# Altium schematic sheet JacdacAccessSwitchInput 34.SchDoc: Complete design
size A4; DocumentNumber: 1; SheetNumber: 1; SheetTotal: 1; VersionControl_RevNumber: 1
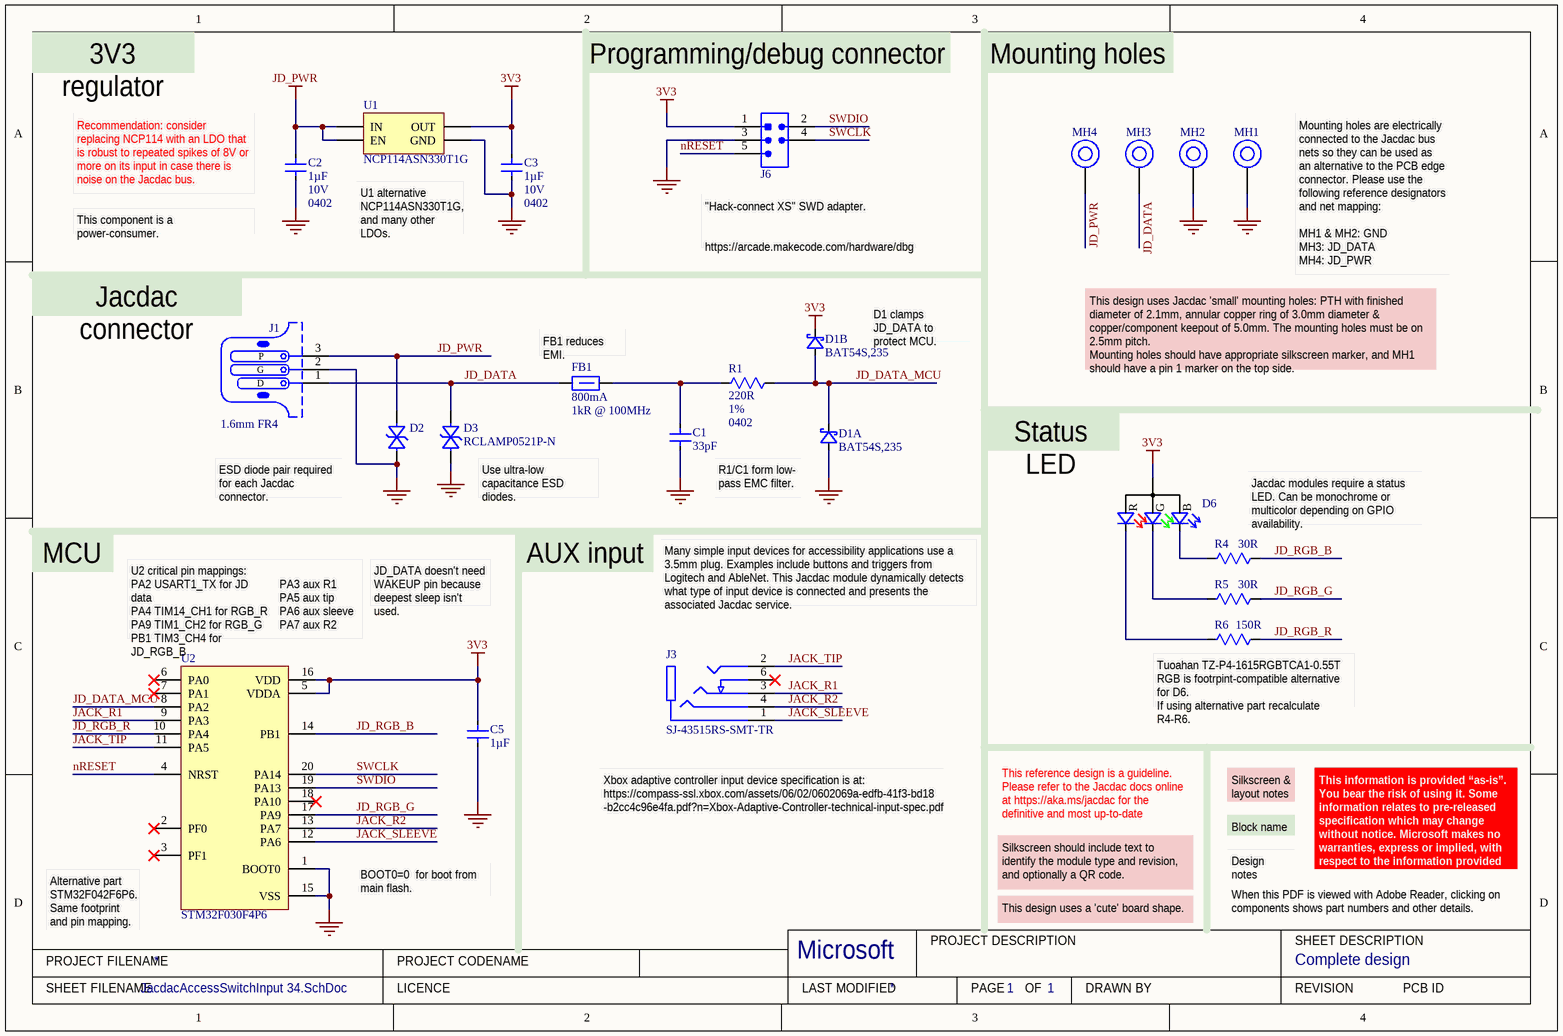
[diagram p0: JacdacAccessSwitchInput 34.SchDoc]

## Parts
C1  Capacitance: 33pF  [C0402_0.55MM - without outline]  (hidden comment: CL05C330JB51PNC)
C2  Capacitance: 1µF  Voltage Rating: 10V  Case Code (Imperial): 0402  [C0402_0.55MM - without outline]  (hidden comment: CL05A105KP5NNNC)
C3  Capacitance: 1µF  Voltage Rating: 10V  Case Code (Imperial): 0402  [C0402_0.55MM - without outline]  (hidden comment: CL05A105KP5NNNC)
C5  Capacitance: 1µF  [C0402_0.55MM - without outline]  (hidden comment: CL05A105KP5NNNC)
D1  Manufacturer Part Number: BAT54S,235  [NXP-BAT54S-TO-236AB - without outline]  (hidden comment: BAT54S)  (parts A,B of 2)
D2  RCLAMP0521P-N  [TVS 0402 - L]  (value not drawn)
D3  RCLAMP0521P-N  [TVS 0402 - L]
D6  HSMF-C114  [HSMF-C114]  (value not drawn)
FB1  Current Rating: 800mA  Impedance: 1kR @ 100MHz  [TDK MPZ1608 0.8mm - without outline]  (hidden comment: TDK MPZ1608S102ATA00)
J1  PCB Type: 1.6mm FR4  [JACDAC_EDGE_CONNECTOR_NO_TRACES]  (hidden comment: 3 pin JACDAC edge connector)  (no BOM)
J3  SJ2-43515RS-SMT  [SJ-43515RS-SMT-TR]  (value not drawn)
J6  Hack Connect Mini 1.27 mm pitch 2-row  [HACK_CONNECT_MINI_5_X_1_27]  (value not drawn)
MH1  MH_5.0MMK_3.0MMC_2.1MMD_PTH  [MH_5.0MMK_3.0MMC_2.1MMD_PTH]  (value not drawn)  (no BOM)
MH2  MH_5.0MMK_3.0MMC_2.1MMD_PTH  [MH_5.0MMK_3.0MMC_2.1MMD_PTH]  (value not drawn)  (no BOM)
MH3  MH_5.0MMK_3.0MMC_2.1MMD_PTH  [MH_5.0MMK_3.0MMC_2.1MMD_PTH]  (value not drawn)  (no BOM)
MH4  MH_5.0MMK_3.0MMC_2.1MMD_PTH  [MH_5.0MMK_3.0MMC_2.1MMD_PTH]  (value not drawn)  (no BOM)
R1  Resistance: 220R  Tolerance: 1%  Case Code (Imperial): 0402  [R0402 - Without outline]  (hidden comment: 0402WGF2200TCE)
R4  Resistance: 30R  [R0402 - Without outline]  (hidden comment: 0402WGF300JTCE)
R5  Resistance: 30R  [R0402 - Without outline]  (hidden comment: 0402WGF300JTCE)
R6  Resistance: 150R  [R0402 - Without outline]  (hidden comment: 0402WGF1500TCE)
U1  LDO 3.3V/300 mA  [ON_SEMI-SOT23-5 - without outline]  (value not drawn)
U2  STM32F030F4P6  [20-TSSOP]

## Nets
3V3: C3.2 C5.2 D1.2(K) D6.1(A) J6.1(VCC) U1.5(OUT) U2.5(VDDA) U2.16(VDD)
GND: C1.1 C2.1 C3.1 C5.1 D1.1(A) D2.2(A) D3.2(A) J1.2(G) J6.3(GND) MH1.1 MH2.1 U1.2(GND) U2.1(BOOT0) U2.15(VSS)
JD_PWR: C2.2 D2.1(K) J1.3(P) MH4.1 U1.1(IN) U1.3(EN)
JACK_R1: J3.3 U2.9(PA3)
JACK_R2: J3.4 U2.13(PA7)
JACK_SLEEVE: J3.1 U2.12(PA6)
JACK_TIP: J3.2 U2.11(PA5)
JD_DATA: D3.1(K) FB1.1 J1.1(D) MH3.1
JD_DATA_MCU: D1.3(K) R1.1 U2.8(PA2)
JD_RGB_B: R4.2 U2.14(PB1)
JD_RGB_G: R5.2 U2.17(PA9)
JD_RGB_R: R6.2 U2.10(PA4)
nRESET: J6.5(RESET) U2.4(NRST)
SWCLK: J6.4(SWCLK) U2.20(PA14)
SWDIO: J6.2(SWDIO) U2.19(PA13)
NetC1_2: C1.2 FB1.2 R1.2
NetD6_2: D6.2(R) R6.1
NetD6_3: D6.3(G) R5.1
NetD6_4: D6.4(B) R4.1

Not connected (* = marked no-connect by the designer): J3 6*; U2 2(PF0)* 3(PF1)* 6(PA0)* 7(PA1)* 18(PA10)*

## Notes on the sheet
- 3V3 regulator
- Programming/debug connector
- Mounting holes
- (near C2) Recommendation: consider replacing NCP114 with an LDO that is robust to repeated spikes of 8V or more on its input in case there is noise on the Jacdac bus.
- (near C2) This component is a power-consumer.
- U1 alternative
  NCP114ASN330T1G, and many other LDOs.
- (near J6) "Hack-connect XS" SWD adapter.
  https://arcade.makecode.com/hardware/dbg
- (near MH1) Mounting holes are electrically connected to the Jacdac bus nets so they can be used as an alternative to the PCB edge connector. Please use the following reference designators and net mapping:
- Jacdac connector
- MH1 & MH2: GND
  MH3: JD_DATA
  MH4: JD_PWR
- (near FB1) FB1 reduces EMI.
- D1 clamps JD_DATA to protect MCU.
- This design uses Jacdac 'small' mounting holes: PTH with finished diameter of 2.1mm, annular copper ring of 3.0mm diameter & copper/component keepout of 5.0mm. The mounting holes must be on 2.5mm pitch.
  Mounting holes should have appropriate silkscreen marker, and MH1 should have a pin 1 marker on the top side.
- (near D6) Status LED
- ESD diode pair required for each Jacdac connector.
- (near D3) Use ultra-low capacitance ESD diodes.
- R1/C1 form low-
  pass EMC filter.
- (near R4) Jacdac modules require a status LED. Can be monochrome or multicolor depending on GPIO availability.
- MCU
- AUX input
- (near U2) U2 critical pin mappings:
  PA2 USART1_TX for JD data
  PA4 TIM14_CH1 for RGB_R
  PA9 TIM1_CH2 for RGB_G
  PB1 TIM3_CH4 for JD_RGB_B
- (near U2) PA3 aux R1
  PA5 aux tip
  PA6 aux sleeve
  PA7 aux R2
- JD_DATA doesn't need WAKEUP pin because deepest sleep isn't used.
- Many simple input devices for accessibility applications use a 3.5mm plug. Examples include buttons and triggers from Logitech and AbleNet. This Jacdac module dynamically detects what type of input device is connected and presents the associated Jacdac service.
- (near R6) Tuoahan TZ-P4-1615RGBTCA1-0.55T RGB is footrpint-compatible alternative for D6.
  If using alternative part recalculate R4-R6.
- (near J3) Xbox adaptive controller input device specification is at:
  https://compass-ssl.xbox.com/assets/06/02/0602069a-edfb-41f3-bd18
  -b2cc4c96e4fa.pdf?n=Xbox-Adaptive-Controller-technical-input-spec.pdf
- This reference design is a guideline. Please refer to the Jacdac docs online at https://aka.ms/jacdac for the definitive and most up-to-date information.
- Block name
- Silkscreen & layout notes
- (near U2) Alternative part STM32F042F6P6. Same footprint and pin mapping.
- BOOT0=0  for boot from main flash.
- This design uses a 'cute' board shape.
- Silkscreen should include text to identify the module type and revision, and optionally a QR code.
- Design notes
- When this PDF is viewed with Adobe Reader, clicking on components shows part numbers and other details.
- This information is provided “as-is”. You bear the risk of using it. Some information relates to pre-released specification which may change without notice. Microsoft makes no warranties, express or implied, with respect to the information provided here.
- PROJECT FILENAME
- PROJECT CODENAME
- Microsoft
- PROJECT DESCRIPTION
- SHEET DESCRIPTION
- SHEET FILENAME
- LICENCE
- LAST MODIFIED
- PAGE
- OF
- DRAWN BY
- REVISION
- PCB ID

## Library data of the parts
C1 = CL05C330JB51PNC: CAP CER 33PF 50V NP0 0402; Manufacturer: Samsung; Tolerance: 5%; Supplier 1: Digi-Key; Manufacturer Part Number: CL05C330JB51PNC; RoHS: Yes; Category: Capacitors; Stock 1: 250654; Pricing 1: 1=0.10000, 10=0.07500, 50=0.04060, 100=0.03320, 500=0.02374, 1000=0.01865, 2500=0.01696, 5000=0.01560 (USD); Mount: Surface Mount; Case/Package: 0402; Case Code (Metric): 1005; Min Operating Temperature: -55°C; Max Operating Temperature: 125°C; Packaging: Tape and Reel; Length: 0.039inch; Width: 0.02inch; Thickness: 0.022inch; Ratings: AEC-Q200; Lead Free: Lead Free; ComponentLink1URL: http://www.samsungsem.com/kr/support/library/product-catalog/mlcc.jsp; ComponentLink1Description: Samsung datasheet online; Supplier 2: Mouser; Stock 2: 97900; Pricing 2: 1=0.11000, 10=0.08200, 100=0.03600, 500=0.02600, 1000=0.02000, 2500=0.01800 (USD); Supplier 3: Future Electronics; Stock 3: 100000; Pricing 3: 10000=0.00780 (USD); Supplier Part Number 3: 6022520; Supplier Part Number 2: 187-CL05C330JB51PNC; Checked: ?; Created: DG; Supplier Part Number 1: 1276-6515-1-ND; Voltage Rating: 50V; Case Code (Imperial): 0402
C2 C3 C5 = CL05A105KP5NNNC: CAP CER 1UF 10V X5R 0402; Manufacturer: Samsung; Material: Ceramic; Tolerance: 10%; Supplier 1: Digi-Key; Manufacturer Part Number: CL05A105KP5NNNC; RoHS: Yes; Category: Capacitors; Stock 1: 5705569; Pricing 1: 1=0.10000, 10=0.03900, 50=0.02100, 100=0.01720, 500=0.01228, 1000=0.00965, 2500=0.00877, 5000=0.00807 (USD); Mount: Surface Mount; Case/Package: 0402; Case Code (Metric): 1005; Contact Plating: Tin; Min Operating Temperature: -55°C; Max Operating Temperature: 85°C; Dielectric: X5R; Package Quantity: 1; Packaging: Tape and Reel; Length: 1mm; Height: 0.5mm; Width: 0.02inch; Thickness: 0.022inch; Depth: 0.5mm; Radiation Hardening: No; ComponentLink1URL: https://datasheet.ciiva.com/15195/getdatasheetpartid-358390-15195630.pdf; ComponentLink1Description: Online datasheet; Supplier 2: Mouser; Stock 2: 928941; Pricing 2: 1=0.10000, 10=0.04200, 100=0.01800, 500=0.01300, 1000=0.01000, 2500=0.00900 (USD); Supplier 3: Farnell; Stock 3: 53670; Pricing 3: 10=0.02450, 100=0.02000, 500=0.01310, 2500=0.00920, 5000=0.00810, 10000=0.00640, 50000=0.00490 (GBP); Supplier Part Number 3: 3013329; Supplier Part Number 2: 187-CL05A105KP5NNNC; Supplier Part Number 1: 1276-1076-1-ND; Created: DG; Checked: ?
  C5: Voltage Rating: 10V; Case Code (Imperial): 0402
D1 = BAT54S: DIODE ARRAY SCHOTTKY 30V SOT23; Manufacturer: Nexperia; Supplier 1: Digi-Key; RoHS: No; Category: Rectifier Diodes; Stock 1: 14011; Pricing 1: 1=0.13000, 10=0.11900, 100=0.05610, 500=0.03326, 1000=0.02185, 5000=0.02138 (USD); ComponentLink1URL: https://assets.nexperia.com/documents/data-sheet/BAT54_SER.pdf; ComponentLink1Description: NXP datasheet online; Supplier 2: Mouser; Supplier 3: RSComponents; Supplier Part Number 2: 771-BAT54S235; Supplier Part Number 3: 1707990; Supplier Part Number 1: 1727-1868-1-ND
D2 D3 = RCLAMP0521P-N: Bidirectional 5V (Max) 6V 16V 3.5A (8/20us) 0402 TVS RoHS; Manufacturer: Born Semiconductor; Package: 0402; Created By: D Gakure; Checked By: ?; Supplier1: LCSC; Supplier1 Part Number: C316043; ComponentLink1Description: Online datasheet; ComponentLink1URL: https://datasheet.lcsc.com/szlcsc/Bourne-Semicon-Shenzhen-RCLAMP0521P-N_C316043.pdf; Manufacturer Part Number: RCLAMP0521P-N
D6 = HSMF-C114: Red, Green, Blue (RGB) 626nm Red, 525nm Green, 470nm Blue LED Indication - Discrete 1.9V Red, 3.4V Green, 3.4V Blue 0606 (1616 Metric); Manufacturer: Broadcom Avago; Color: Blue,Green,Red; Lens Color: White; Viewing Angle: 145°; Luminous Intensity: 70mcd; Lens Style: Diffused,Rectangular; Forward Current: 20mA; Lens Transparency: Diffused; Number of Elements: 3; Reverse Voltage: 5V; Power Rating: 78mW; Supplier 1: Digi-Key; Manufacturer Part Number: HSMF-C114; RoHS: Yes; Category: Optoelectronics; Stock 1: 20555; Pricing 1: 1=1.78000, 10=1.12500, 100=0.83250, 500=0.76500, 1000=0.63000, 2000=0.59850 (USD); Mount: Surface Mount; Case/Package: 0606; Number of Pins: 4; Case Code (Metric): 1616; Case Code (Imperial): 0606; Min Operating Temperature: -40°C; Max Operating Temperature: 85°C; Forward Voltage: 3.4V; Packaging: Tape and Reel; Wavelength: 470nm; Package Quantity: 4000; Dominant Wavelength: 470nm; Test Current: 20mA; Number of LEDs: 3; Length: 1.6mm; Width: 1.5mm; Height: 0.35mm; Depth: 1.6mm; Radiation Hardening: No; REACH SVHC: No SVHC; Lead Free: Lead Free; Supplier 2: Farnell; Stock 2: 8134; Pricing 2: 1=1.56000, 10=0.97100, 25=0.87800, 50=0.78500, 100=0.69200, 500=0.60500 (GBP); Supplier 3: Mouser; Stock 3: 14991; Pricing 3: 1=1.69000, 10=1.13000, 50=1.13000, 100=0.85600, 1000=0.74800, 10000=0.74800 (USD); Supplier Part Number 1: 516-1795-1-ND; Supplier Part Number 3: 630-HSMF-C114; Supplier Part Number 2: 1058362; ComponentLink1Description: Online datasheet; ComponentLink1URL: https://docs.broadcom.com/docs/AV02-2451EN; Created By: D. Gakure; Checked By: ?
FB1 = TDK MPZ1608S102ATA00: 0603 1k@100MHz 0.8A chip; Core Material: Ferrite; Tolerance: 25%; DC Resistance (DCR): 300mR; Supplier 1: Digi-Key; Stock 1: 113542; Pricing 1: 1=0.1, 10=0.079, 25=0.0716, 50=0.0644, 100=0.0472, 250=0.03432, 500=0.03146, 1000=0.02717 (USD); Mount: Surface Mount; Case/Package: 0603; Case Code (Metric): 1608; Case Code (Imperial): 0603; Package Quantity: 4000; Packaging: Tape and Reel; Max DC Current: 800mA; Length: 0.063inch; Height: 0.037inch; Width: 0.031inch; ComponentLink2URL: https://www.mouser.co.uk/datasheet/2/400/eads_commercial_power_mpz1608_en-923650.pdf; ComponentLink2Description: datasheet online; Supplier 2: Mouser; ComponentLink3Description: datasheet; ComponentLink3URL: Y:\System\Altium\Libraries 2014\TDK\Datasheets\eads_commercial_power_mpz1608_en-923650.pdf; Supplier Part Number 1: 445-8694-1-ND; Supplier Part Number 2: 810-MPZ1608S102ATA00; Manufacturer: TDK; Manufacturer Part Number: MPZ1608S102ATA00
J1 = Jacdac edge connector: 3 pin Jacdac edge connector 1.27mm pitch; Manufacturer Part Number: JACDAC_EDGE_CONNECTOR; Checked By: ?; Created By: D. Gakure; ComponentLink1Description: Yuliang JACDAC cable connector drawing online; ComponentLink1URL: https://github.com/microsoft/jacdac-mdk/blob/main/connector/JACDAC-Connector-by-Yuliang-2020-11-28.pdf; ComponentLink2Description: JACDAC PCB edge connector spec onlin; ComponentLink2URL: https://github.com/microsoft/jacdac-mdk/blob/main/connector/JACDAC_PCB_Edge_Connector_Drawing_JD-PEC-01_rev_01.pdf
J3 = SJ2-43515RS-SMT: 4-way 3.5mm jack socket SMD R/A TRRS; Manufacturer: CUI; Number of Conductors: 5; Number of Ports: 1; Shielding: Unshielded; Stock 1: 2113; Pricing 1: 1=1.15, 10=1.013, 25=0.9532, 50=0.9134, 100=0.8736, 250=0.7942, 500=0.71478 (USD); Color: Black; Connector Type: Jack; Orientation: Horizontal; ComponentLink1Description: CUI datasheet; ComponentLink1URL: https://www.cuidevices.com/product/resource/sj-4351x-smt.pdf; Supplier 1: Digi-Key; Supplier Part Number 1: CP-43515RSSJCT-ND; Manufacturer Part Number: SJ-43515RS-SMT-TR
J6 = HACK_CONNECT_MINI
MH1-MH4 = MH_5.0MMK_3.0MMC_2.1MMD_PTH: Mounting Hole 5.0mm keepout, 3.0mm annualar ring and 2.1mm Drill PTH
R1 = 0402WGF2200TCE: RES SMD 220 OHM 1% 1/16W 0402; Manufacturer: Uniroyal Elec; Manufacturer Part Number: 0402WGF2200TCE; ComponentLink1Description: datasheet (offline); ComponentLink1URL: Y:\System\Altium\Libraries 2014\Uniroyal Elec\Datasheets\Uniro
R4 R5 = 0402WGF300JTCE: RES SMD 30 OHM 1% 1/16W 0402; Manufacturer: Uniroyal Elec; Manufacturer Part Number: 0402WGF300JTCE; ComponentLink1Description: datasheet (offline); ComponentLink1URL: Y:\System\Altium\Libraries 2014\Uniroyal Elec\Datasheets\Uniro; Tolerance: 1%; Case Code (Imperial): 0402
R6 = 0402WGF1500TCE: RES SMD 150 OHM 1% 1/16W 0402; Manufacturer: Uniroyal Elec; Manufacturer Part Number: 0402WGF1500TCE; ComponentLink1Description: datasheet (offline); ComponentLink1URL: Y:\System\Altium\Libraries 2014\Uniroyal Elec\Datasheets\Uniro; Tolerance: 1%; Case Code (Imperial): 0402
U1 = NCP114ASN330T1G: ON SEMICONDUCTOR - NCP114ASN330T1G - LDO Voltage Regulator, Fixed, 1.7 V to 5.5 V in, 3.3 V/300 mA out, 150 mV drop, TSOP-5; Output Current: 300mA; Output Configuration: Positive; Number of Regulators: 1; Max Input Voltage: 5.5V; Min Output Voltage: 3.3V; Dropout Voltage: 225mV; Quiescent Current: 95uA; Power Supply Rejection Ratio (PSRR): 75dB; Supplier 1: Digi-Key; RoHS: No; Category: Voltage Regulators - Linear; Stock 1: 32529; Pricing 1: 1=0.33000, 10=0.24900, 25=0.21760, 100=0.12440, 250=0.11664, 500=0.09330, 1000=0.07153 (USD); Mount: Surface Mount; Case/Package: SOT-23-5; Min Operating Temperature: -40°C; Max Operating Temperature: 85°C; Output Type: Fixed; Packaging: Cut Tape; Lead Free: Lead Free; ComponentLink3URL: http://www.onsemi.com/pub/Collateral/NCP114-D.PDF; ComponentLink3Description: On Semi datasheet online; Supplier 2: RSComponents; Supplier 3: Mouser; Supplier Part Number 3: 863-NCP114ASN330T1G; Supplier Part Number 2: 1263178; Supplier Part Number 1: NCP114ASN330T1GOSCT-ND; Created: DG; Checked: ?; Manufacturer: ON Semiconductor; Manufacturer Part Number: NCP114ASN330T1G
U2 = ST STM32F030F4P6: STMICROELECTRONICS - STM32F030F4P6 - 32 Bit Microcontroller, Value Line, ARM Cortex-M0, 48 MHz, 16 KB, 4 KB, 20, TSSOP RoHS Compliant: Yes; Max Supply Voltage: 3.6V; Frequency: 48MHz; Interface: I2C,SPI,UART,USART; RAM Size: 4KB; Max Power Dissipation: 182mW; Number of I/Os: 15; Number of Timers/Counters: 5; Min Supply Voltage: 2.4V; Number of ADC Channels: 16; Oscillator Type: Internal; Data Bus Width: 32b; Number of SPI Channels: 1; Memory Type: FLASH; Memory Size: 16KB; Peripherals: POR,PWM,WDT,DMA; Number of PWM Channels: 6; Categories: Integrated Circuits; Supplier 1: Farnell; Manufacturer: STMicroelectronics; RoHS: Yes; Category: Microcontrollers; Stock 1: 1196; Pricing 1: 1=0.97500, 25=0.85400, 50=0.75500, 100=0.65600, 250=0.61800, 500=0.58000, 1000=0.52500, 2500=0.46900 (GBP); Case/Package: TSSOP; Number of Pins: 20; Contact Plating: Gold; Min Operating Temperature: -40°C; Max Operating Temperature: 85°C; Package Quantity: 74; Packaging: Rail/Tube; Number of Programmable I/O: 15; Max Frequency: 48MHz; Number of I2C Channels: 1; Watchdog Timer: Yes; Core Architecture: ARM; Length: 6.6mm; Height: 1.05mm; Width: 4.5mm; Radiation Hardening: No; REACH SVHC: No SVHC; Lead Free: Lead Free; ComponentLink1URL: https://datasheet.ciiva.com/29720/dm00088500-29720640.pdf; ComponentLink1Description: Online datasheet; Supplier Part Number 1: 2393635; Created: DG; Checked: ?; Supplier Part Number 2: 497-14044-5-ND; Supplier 2: Digi-Key; Supplier 3: RSComponents; Stock 3: 48; Pricing 3: 100=0.43900, 250=0.38800, 1000=0.37300 (GBP); Supplier Part Number 3: 7925925P; Manufacturer Part Number: STM32F030F4P6